# EAGLE design schematic (EAGLE 9.6.2)
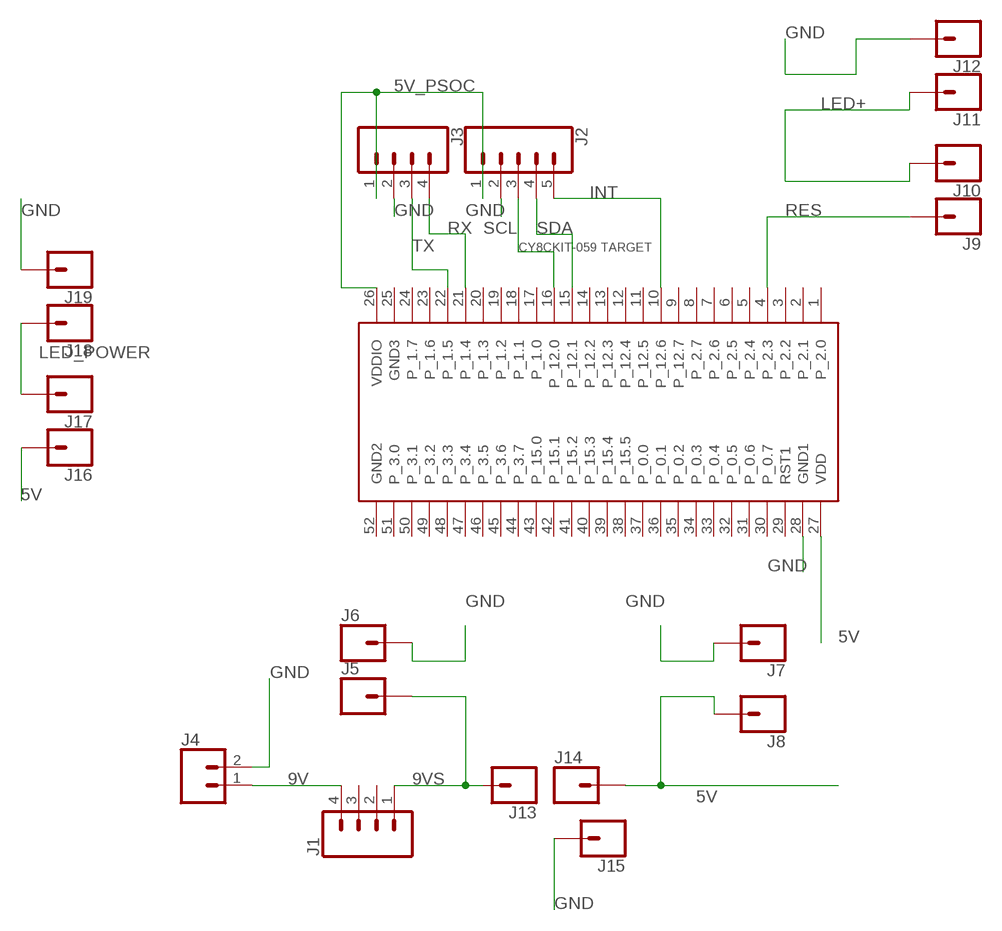
[diagram p0: schematic, sheet 1]

## Parts
J1  CONN_041X04_NO_SILK  [1X04_NO_SILK]
J2  CONN_05NO_SILK  [1X05_NO_SILK]
J3  CONN_041X04_NO_SILK  [1X04_NO_SILK]
J4  CONN_021X02_NO_SILK  [1X02_NO_SILK]
J5  CONN_01PTH_NO_SILK_YES_STOP  [1X01_NO_SILK]
J6  CONN_01PTH_NO_SILK_YES_STOP  [1X01_NO_SILK]
J7  CONN_01PTH_NO_SILK_YES_STOP  [1X01_NO_SILK]
J8  CONN_01PTH_NO_SILK_YES_STOP  [1X01_NO_SILK]
J9  CONN_01PTH_NO_SILK_YES_STOP  [1X01_NO_SILK]
J10  CONN_01PTH_NO_SILK_YES_STOP  [1X01_NO_SILK]
J11  CONN_01PTH_NO_SILK_YES_STOP  [1X01_NO_SILK]
J12  CONN_01PTH_NO_SILK_YES_STOP  [1X01_NO_SILK]
J13  CONN_01PTH_NO_SILK_YES_STOP  [1X01_NO_SILK]
J14  CONN_01PTH_NO_SILK_YES_STOP  [1X01_NO_SILK]
J15  CONN_01PTH_NO_SILK_YES_STOP  [1X01_NO_SILK]
J16  CONN_01PTH_NO_SILK_YES_STOP  [1X01_NO_SILK]
J17  CONN_01PTH_NO_SILK_YES_STOP  [1X01_NO_SILK]
J18  CONN_01PTH_NO_SILK_YES_STOP  [1X01_NO_SILK]
J19  CONN_01PTH_NO_SILK_YES_STOP  [1X01_NO_SILK]
U$2  CY8CKIT-059_TARGET_3  [CY8CKIT-059_TARGET_3]

## Nets
5V: J8.1 J14.1 J16.1 U$2.27(VDD)
5V_PSOC: J2.1 J3.1 U$2.26(VDDIO)
9V: J1.4 J4.1
9VS: J1.1 J5.1 J13.1
GND: J2.2 J3.2 J4.2 J6.1 J7.1 J12.1 J15.1 J19.1 U$2.28(GND1)
INT: J2.5 U$2.10(P_12.6)
LED+: J10.1 J11.1
LED_POWER: J17.1 J18.1
RES: J9.1 U$2.4(P_2.3)
RX: J3.4 U$2.21(P_1.4)
SCL: J2.3 U$2.16(P_12.0)
SDA: J2.4 U$2.15(P_12.1)
TX: J3.3 U$2.22(P_1.5)
Unconnected: J1.2 J1.3 U$2.1(P_2.0) U$2.2(P_2.1) U$2.3(P_2.2) U$2.5(P_2.4) U$2.6(P_2.5) U$2.7(P_2.6) U$2.8(P_2.7) U$2.9(P_12.7) U$2.11(P_12.5) U$2.12(P_12.4) U$2.13(P_12.3) U$2.14(P_12.2) U$2.17(P_1.0) U$2.18(P_1.1) U$2.19(P_1.2) U$2.20(P_1.3) U$2.23(P_1.6) U$2.24(P_1.7) U$2.29(RST1) U$2.30(P_0.7) U$2.31(P_0.6) U$2.32(P_0.5) U$2.33(P_0.4) U$2.34(P_0.3) U$2.35(P_0.2) U$2.36(P_0.1) U$2.37(P_0.0) U$2.38(P_15.5) U$2.39(P_15.4) U$2.40(P_15.3) U$2.41(P_15.2) U$2.42(P_15.1) U$2.43(P_15.0) U$2.44(P_3.7) U$2.45(P_3.6) U$2.46(P_3.5) U$2.47(P_3.4) U$2.48(P_3.3) U$2.49(P_3.2) U$2.50(P_3.1) U$2.51(P_3.0)

## Power pins joined to a net without a drawn wire
GND2: U$2.52(GND2)
GND3: U$2.25(GND3)

## Library data of the parts
J1 J3 = SparkFun-Connectors:CONN_04: Multi connection point. Often used as Generic Header-pin footprint for 0.1 inch spaced/style header connections On any of the 0.1 inch spaced packages, you can populate with these: Break Away Headers - Straight <https://www.sparkfun.com/products/116> (PRT-00116) Break Away Male Headers - Right Angle <https://www.sparkfun.com/products/553> (PRT-00553) Female Headers <https://www.sparkfun.com/products/115> (PRT-00115) Break Away Headers - Machine Pin <https://www.sparkfun.com/products/117> (PRT-00117) Break Away Female Headers - Swiss Machine Pin <https://www.sparkfun.com/products/743> (PRT-00743) For SCREWTERMINALS and SPRING TERMINALS visit here: Screw Terimnals on SparkFun.com <https://www.sparkfun.com/search/results?term=Screw+Terminals> (5mm/3.5mm/2.54mm spacing) This device is also useful as a general connection point to wire up your design to another part of your project. Our various solder wires solder well into these plated through hole pads. Hook-Up Wire - Assortment (Stranded, 22 AWG) <https://www.sparkfun.com/products/11375> (PRT-11375) Hook-Up Wire - Assortment (Solid Core, 22 AWG) <https://www.sparkfun.com/products/11367> (PRT-11367) View the entire wire category on our website here <https://www.sparkfun.com/categories/141> Special notes: Molex polarized connector foot print use with SKU : PRT-08231 with associated crimp pins and housings. 1MM SMD Version SKU: PRT-10208; PROD_ID: CONN-09696
J2 = SparkFun-Connectors:CONN_05: Multi connection point. Often used as Generic Header-pin footprint for 0.1 inch spaced/style header connections On any of the 0.1 inch spaced packages, you can populate with these: Break Away Headers - Straight <https://www.sparkfun.com/products/116> (PRT-00116) Break Away Male Headers - Right Angle <https://www.sparkfun.com/products/553> (PRT-00553) Female Headers <https://www.sparkfun.com/products/115> (PRT-00115) Break Away Headers - Machine Pin <https://www.sparkfun.com/products/117> (PRT-00117) Break Away Female Headers - Swiss Machine Pin <https://www.sparkfun.com/products/743> (PRT-00743) For SCREWTERMINALS and SPRING TERMINALS visit here: Screw Terimnals on SparkFun.com <https://www.sparkfun.com/search/results?term=Screw+Terminals> (5mm/3.5mm/2.54mm spacing) This device is also useful as a general connection point to wire up your design to another part of your project. Our various solder wires solder well into these plated through hole pads. Hook-Up Wire - Assortment (Stranded, 22 AWG) <https://www.sparkfun.com/products/11375> (PRT-11375) Hook-Up Wire - Assortment (Solid Core, 22 AWG) <https://www.sparkfun.com/products/11367> (PRT-11367) View the entire wire category on our website here <https://www.sparkfun.com/categories/141> Special notes: Molex polarized connector foot print use with SKU : PRT-08231 with associated crimp pins and housings. 1MM SMD Version SKU: PRT-10208
J4 = SparkFun-Connectors:CONN_02: Multi connection point. Often used as Generic Header-pin footprint for 0.1 inch spaced/style header connections On any of the 0.1 inch spaced packages, you can populate with these: Break Away Headers - Straight <https://www.sparkfun.com/products/116> (PRT-00116) Break Away Male Headers - Right Angle <https://www.sparkfun.com/products/553> (PRT-00553) Female Headers <https://www.sparkfun.com/products/115> (PRT-00115) Break Away Headers - Machine Pin <https://www.sparkfun.com/products/117> (PRT-00117) Break Away Female Headers - Swiss Machine Pin <https://www.sparkfun.com/products/743> (PRT-00743) For SCREWTERMINALS and SPRING TERMINALS visit here: Screw Terimnals on SparkFun.com <https://www.sparkfun.com/search/results?term=Screw+Terminals> (5mm/3.5mm/2.54mm spacing) This device is also useful as a general connection point to wire up your design to another part of your project. Our various solder wires solder well into these plated through hole pads. Hook-Up Wire - Assortment (Stranded, 22 AWG) <https://www.sparkfun.com/products/11375> (PRT-11375) Hook-Up Wire - Assortment (Solid Core, 22 AWG) <https://www.sparkfun.com/products/11367> (PRT-11367) View the entire wire category on our website here <https://www.sparkfun.com/categories/141> Special notes: Molex polarized connector foot print use with: PRT-08233 with associated crimp pins and housings. 2.54_SCREWTERM for use with PRT-10571. 3.5mm Screw Terminal footprints for PRT-08084 5mm Screw Terminal footprints for use with PRT-08432
J5-J19 = SparkFun-Connectors:CONN_01: Single connection point. Often used as Generic Header-pin footprint for 0.1 inch spaced/style header connections On any of the 0.1 inch spaced packages, you can populate with these: Break Away Headers - Straight <https://www.sparkfun.com/products/116> (PRT-00116) Break Away Male Headers - Right Angle <https://www.sparkfun.com/products/553> (PRT-00553) Female Headers <https://www.sparkfun.com/products/115> (PRT-00115) Break Away Headers - Machine Pin <https://www.sparkfun.com/products/117> (PRT-00117) Break Away Female Headers - Swiss Machine Pin <https://www.sparkfun.com/products/743> (PRT-00743) This device is also useful as a general connection point to wire up your design to another part of your project. Our various solder wires solder well into these plated through hole pads. Hook-Up Wire - Assortment (Stranded, 22 AWG) <https://www.sparkfun.com/products/11375> (PRT-11375) Hook-Up Wire - Assortment (Solid Core, 22 AWG) <https://www.sparkfun.com/products/11367> (PRT-11367) View the entire wire category on our website here <https://www.sparkfun.com/categories/141> Special notes: SMTSO-256-ET is a "flush mount" nut for a 4-40 screw. We mostly use this on specialty testbeds; it is a nice way to connect hardware to your PCB at an adjustable hieght. Also note, the SNAP packages are for using a snappable style connector. We sell a baggie of snaps and they are also used on two LilyPad designs: Snap Assortment - 30 pack (male and female) <https://www.sparkfun.com/products/11347> (DEV-11347) LilyPad Arduino SimpleSnap <https://www.sparkfun.com/products/10941> (DEV-10941) LilyPad SimpleSnap Protoboard <https://www.sparkfun.com/products/10940> (DEV-10940)
U$2 = CYKIT:CY8CKIT-059_TARGET_3

## Board
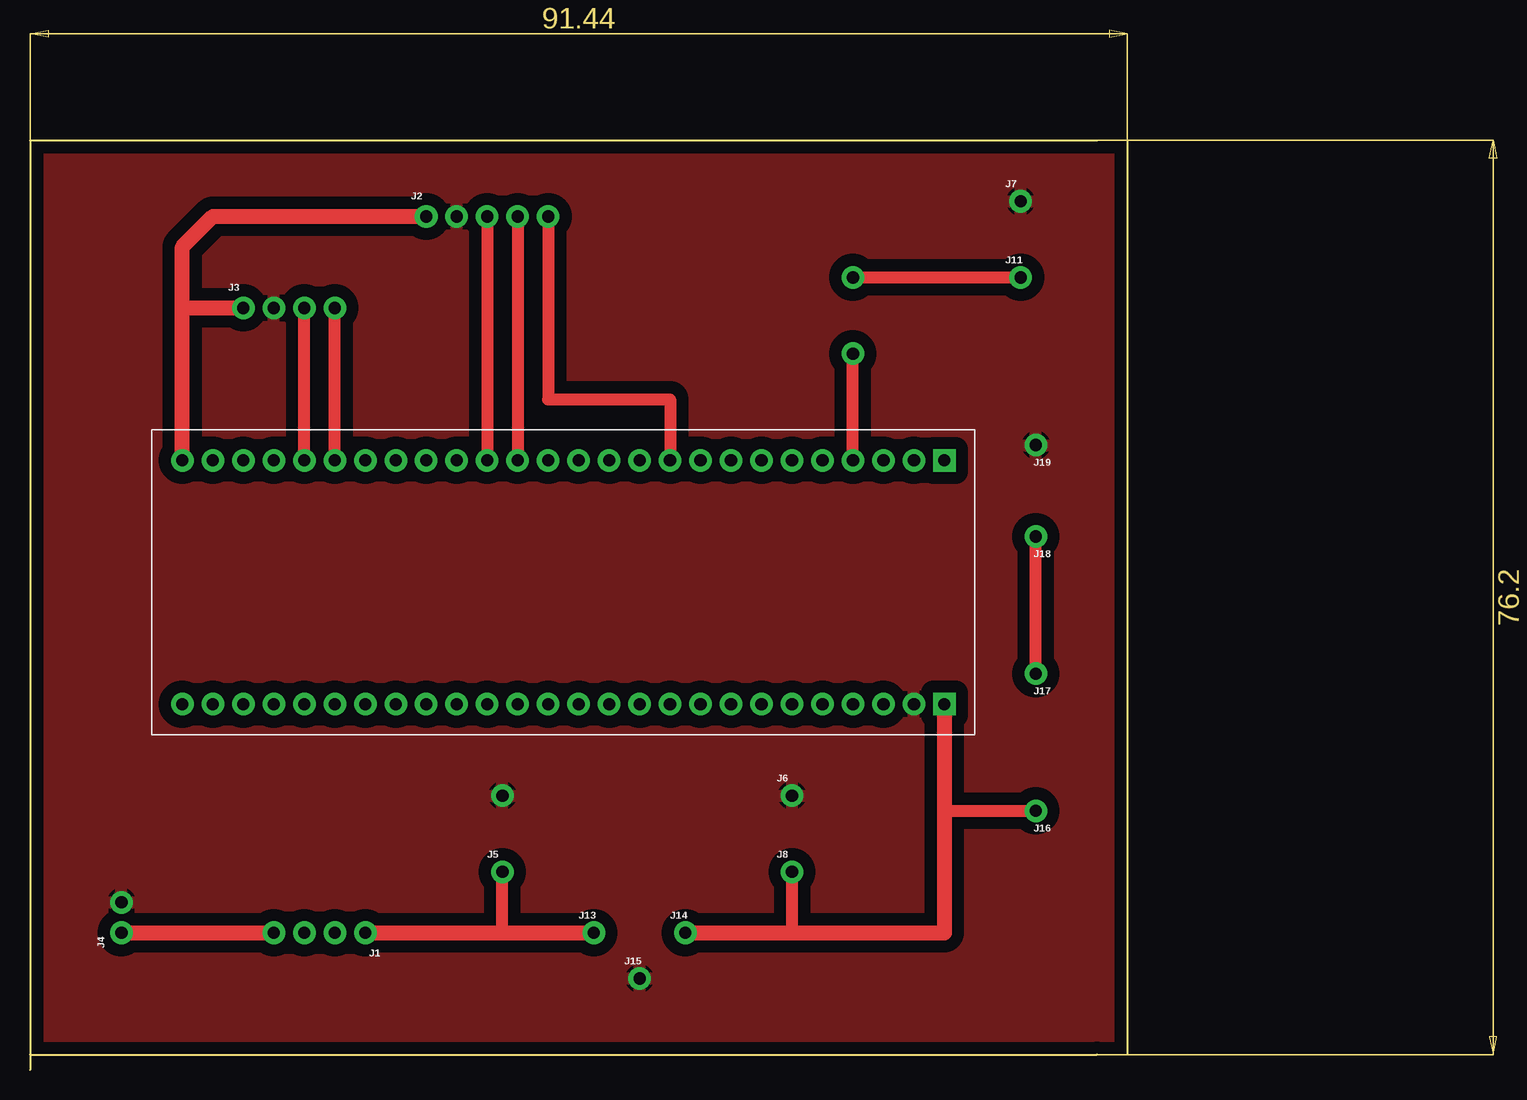
[diagram p1: board, top side]

Size 91.44 x 77.47 mm. Coordinates in mm from the lower left corner, seen from the top.
Outline: 0,1.27 88.9,1.27
Outline: 0,0 0,77.47 88.9,77.47
Outline: 91.44,77.47 91.44,1.27
Copper layers (1*16): Top 0.035mm / dielectric 1.5mm / Bottom 0.035mm
Design rules "default": minimum track width 6mil, minimum drill 0.35mm, track to track 6mil, track to pad 6mil, pad to pad 6mil, via to via 6mil, smd to smd 6mil, copper to edge 40mil, drill to drill 6mil, minimum pad ring 10mil, minimum via ring 8mil, stop-mask expansion 4mil, vias tented up to drill 0mil, thermal gap 10mil

### Footprints (pad centres in the part's own frame; a part is rotated, then mirrored left to right if it is on the bottom)
1X04_NO_SILK = drill 1.016 pad 1.88: 1 0,0; 2 2.54,0; 3 5.08,0; 4 7.62,0
1X05_NO_SILK = drill 1.016 pad 1.88: 1 0,0; 2 2.54,0; 3 5.08,0; 4 7.62,0; 5 10.16,0
1X02_NO_SILK = drill 1.016 pad 1.88: 1 0,0; 2 2.54,0
1X01_NO_SILK = drill 1.016 pad 1.88: 1 0,0
CY8CKIT-059_TARGET_3 = drill 1.016 pad 1.876 square: 1 30.48,8.89; 27 30.48,-11.43 | drill 1.016 pad 1.876: 2 27.94,8.89; 3 25.4,8.89; 4 22.86,8.89; 5 20.32,8.89; 6 17.78,8.89; 7 15.24,8.89; 8 12.7,8.89; 9 10.16,8.89; 10 7.62,8.89; 11 5.08,8.89; 12 2.54,8.89; 13 0,8.89; 14 -2.54,8.89; 15 -5.08,8.89; 16 -7.62,8.89; 17 -10.16,8.89; 18 -12.7,8.89; 19 -15.24,8.89; 20 -17.78,8.89; 21 -20.32,8.89; 22 -22.86,8.89; 23 -25.4,8.89; 24 -27.94,8.89; 25 -30.48,8.89; 26 -33.02,8.89; 28 27.94,-11.43; 29 25.4,-11.43; 30 22.86,-11.43; 31 20.32,-11.43; 32 17.78,-11.43; 33 15.24,-11.43; 34 12.7,-11.43; 35 10.16,-11.43; 36 7.62,-11.43; 37 5.08,-11.43; 38 2.54,-11.43; 39 0,-11.43; 40 -2.54,-11.43; 41 -5.08,-11.43; 42 -7.62,-11.43; 43 -10.16,-11.43; 44 -12.7,-11.43; 45 -15.24,-11.43; 46 -17.78,-11.43; 47 -20.32,-11.43; 48 -22.86,-11.43; 49 -25.4,-11.43; 50 -27.94,-11.43; 51 -30.48,-11.43; 52 -33.02,-11.43

### Placement (x,y rotation side)
J1  27.94,11.43 180 top
J2  33.02,71.12 0 top
J3  17.78,63.5 0 top
J4  7.62,11.43 90 top
J5  39.37,16.51 0 top
J6  63.5,22.86 0 top
J7  82.55,72.39 0 top
J8  63.5,16.51 0 top
J9  68.58,59.69 270 bottom
J10  68.58,66.04 0 bottom
J11  82.55,66.04 0 top
J12  39.37,22.86 270 bottom
J13  46.99,11.43 0 top
J14  54.61,11.43 0 top
J15  50.8,7.62 0 top
J16  83.82,21.59 180 top
J17  83.82,33.02 180 top
J18  83.82,44.45 180 top
J19  83.82,52.07 180 top
U$2  45.72,41.91 0 top

### Tracks (layer width: path | path; a pad name or v marks a point on that pad's centre or on a via)
5V
  Top 1.016: 63.5,11.43 J8.1 | 76.2,21.59 J16.1
  Top 1.27: J14.1 63.5,11.43 76.2,11.43 76.2,21.59 U$2.27
5V_PSOC
  Top 1.27: U$2.26 12.7,63.5 | 12.7,63.5 J3.1 | 12.7,63.5 12.7,68.58 15.24,71.12 J2.1
9V
  Top 1.27: J4.1 J1.4
9VS
  Top 1.016: 39.37,11.43 J5.1
  Top 1.27: J1.1 39.37,11.43 J13.1
GND
  pour Top (isolate 1.016): 0,1.27 91.44,1.27 91.44,77.47 0,77.47 0,2.54
  pour Top (isolate 1.27): 0,1.27 91.44,1.27 91.44,77.47 0,77.47
  pour Top (isolate 1.27): 0,1.27 91.44,1.27 91.44,77.47 0,77.47
INT
  Top 1.016: U$2.10 53.34,55.88 43.18,55.88 J2.5
LED+
  Top 1.016: J10.1 J11.1
LED_POWER
  Top 1.016: J17.1 J18.1
RES
  Top 1.016: U$2.4 J9.1
RX
  Top 1.016: U$2.21 J3.4
SCL
  Top 1.016: J2.3 U$2.16
SDA
  Top 1.016: J2.4 U$2.15
TX
  Top 1.016: U$2.22 J3.3